# Altium project Simple.PrjPcb
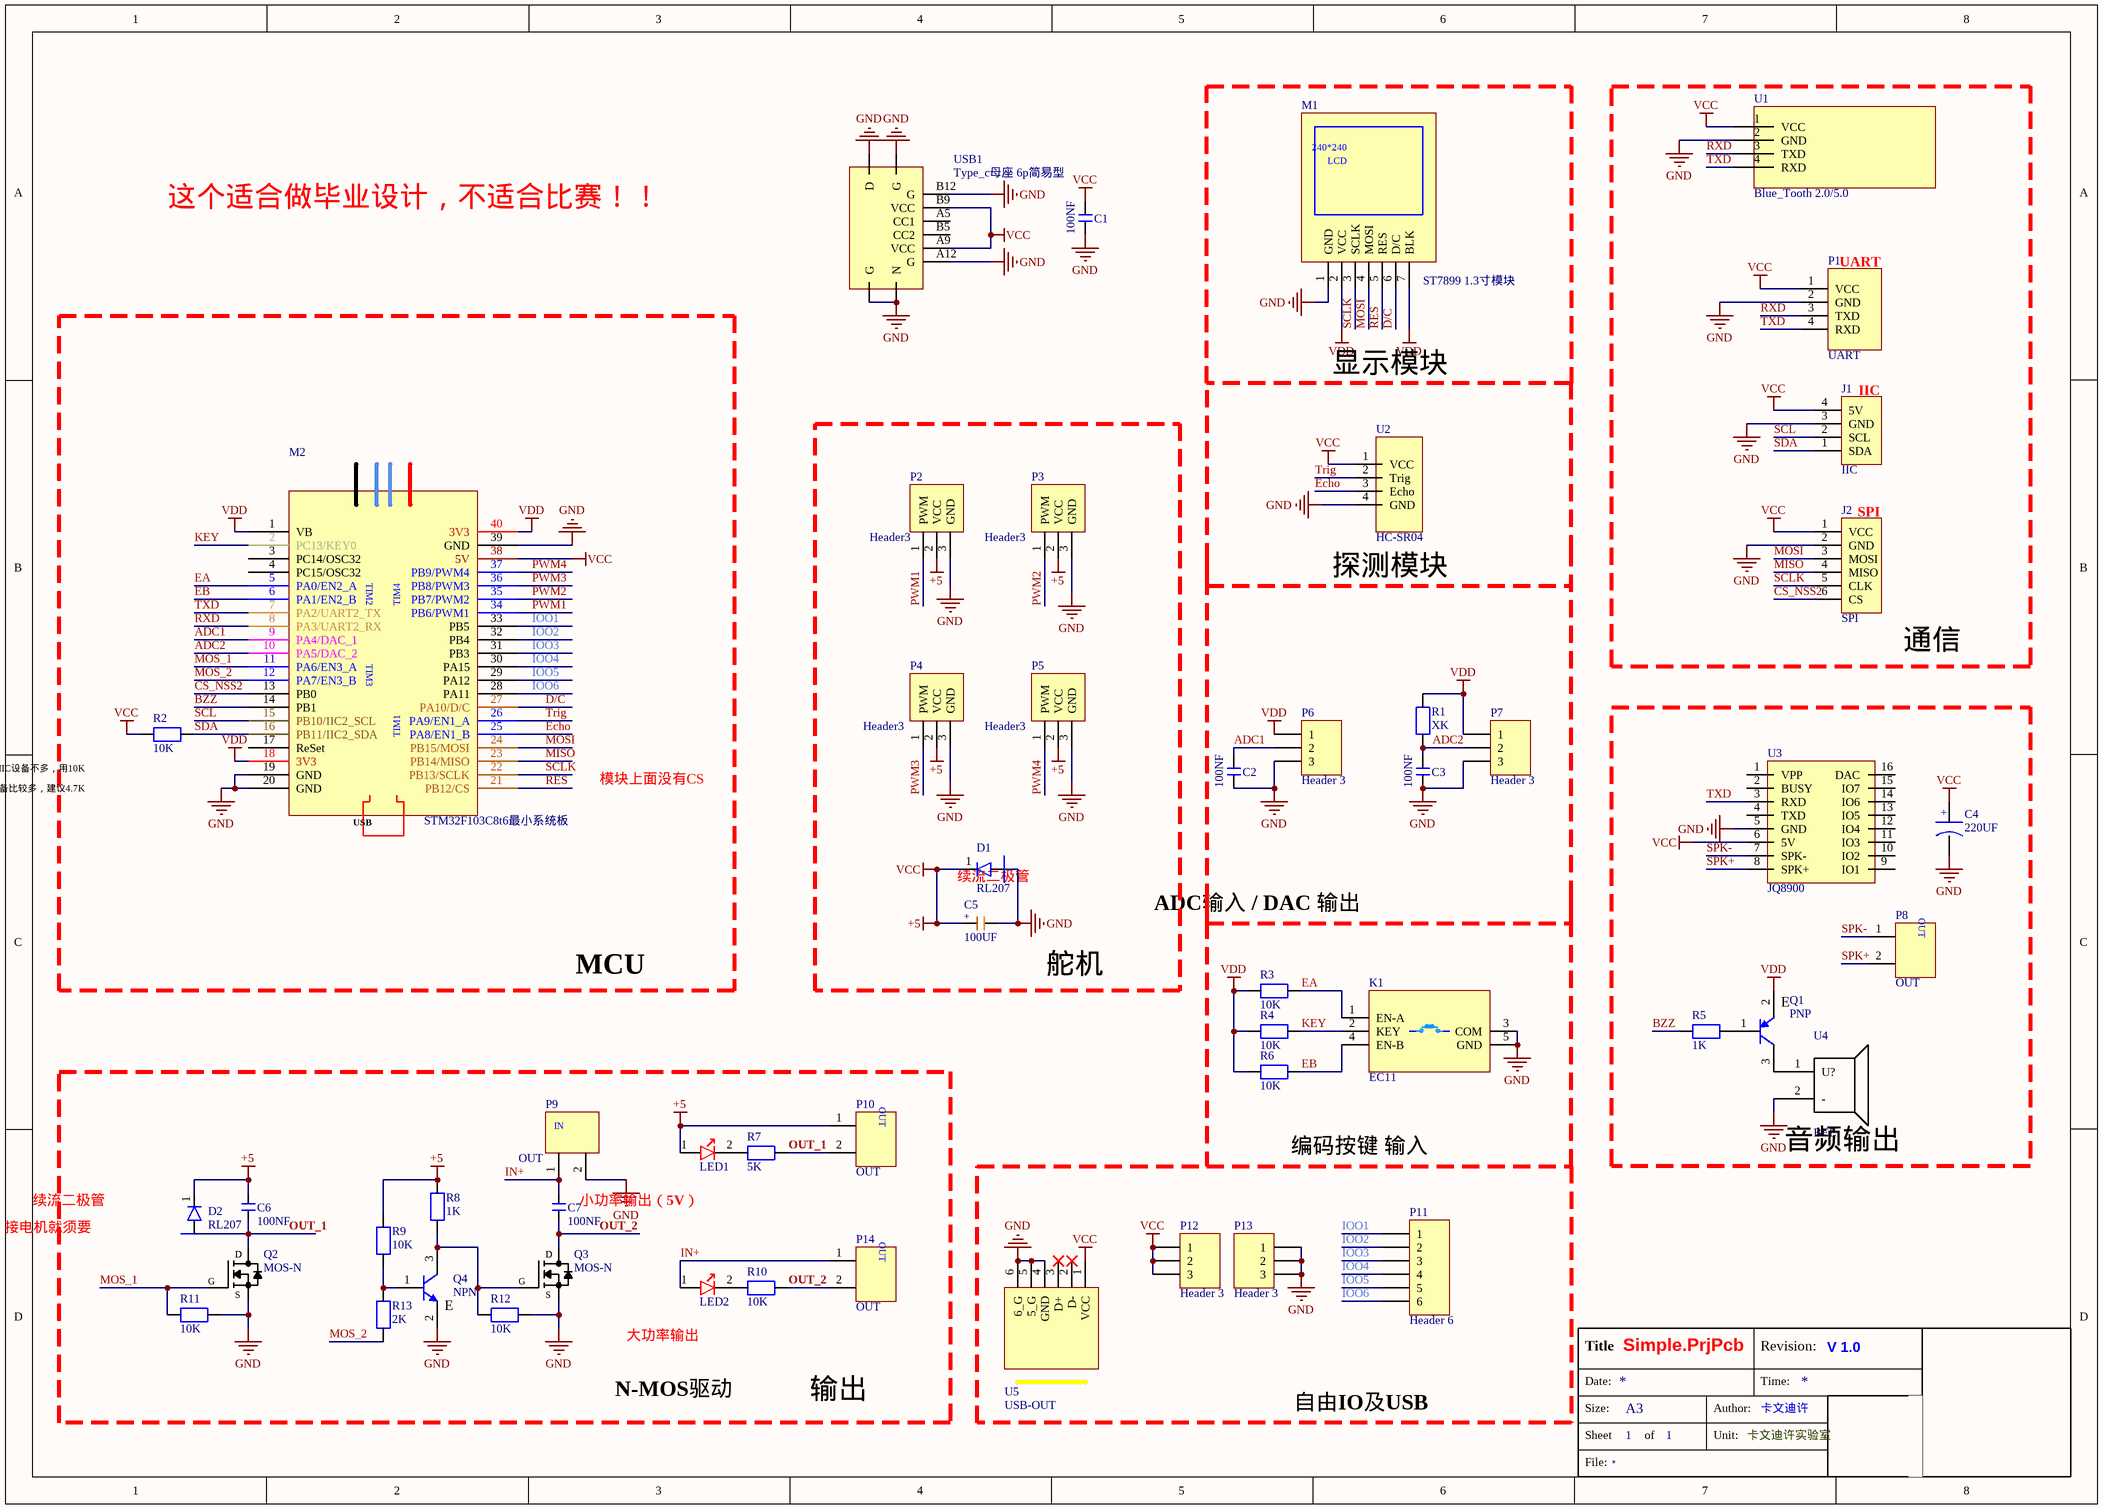
[diagram p0: Sheet.SchDoc]
1 sheet, 53 parts. Net scope: global (net labels, ports and power ports of the same name join across sheets).
Board file: PCB.PcbDoc

## Sheet Sheet.SchDoc
size A3; Author: 卡文迪许; CompanyName: 卡文迪许实验室; Revision: V 1.0; SheetNumber: 1; SheetTotal: 1

### Parts
C1  100NF  [CAP_0603]
C2  100NF  [CAP_0603]
C3  100NF  [CAP_0603]
C4  220UF  [CAP_PR_2.5_6.3_RA]
C5  100UF  [CAP_3528_B]
C6  100NF  [CAP_0603]
C7  100NF  [CAP_0603]
D1  RL207  [Diode_DO15]
D2  RL207  [Diode_DO15]
J1  IIC  [IIC-XH2.54-4PIN]
J2  SPI  [Header 2.54X6]
K1  EC11  [EC-11]
LED1  LED_R/G/B/Y  [LED_5MM]  (value not drawn)
LED2  LED_R/G/B/Y  [LED_5MM]  (value not drawn)
M1  ST7899 1.3寸模块  [LCD_1.3_MODE]
M2  STM32F103C8t6最小系统板  [STM32F103C8_Simple]
P1  UART  [UART]
P2  Header3  [PWM_Steer-F]
P3  Header3  [PWM_Steer-B]
P4  Header3  [PWM_Steer-F]
P5  Header3  [PWM_Steer-B]
P6  Header 3  [Header 2.54X3]
P7  Header 3  [Header 2.54X3]
P8  OUT  [XH2.54-WI-2P]
P9  OUT  [XT60-PW-M20]
P10  OUT  [Header 2.54X2]
P11  Header 6  [Header 2.54X6]
P12  Header 3  [Header 2.54X3]
P13  Header 3  [Header 2.54X3]
P14  OUT  [PIN-2_5.08]
Q1  PNP  [SOT23_3]
Q2  MOS-N  [SOT23_3]
Q3  MOS-N  [TO252_2]
Q4  NPN  [SOT23_3]
R1  XK  [RES_0.4_1/4W]
R2  10K  [RES_0.4_1/4W]
R3  10K  [RES_0.4_1/4W]
R4  10K  [RES_0.4_1/4W]
R5  1K  [RES_0.4_1/4W]
R6  10K  [RES_0.4_1/4W]
R7  5K  [RES_0.4_1/4W]
R8  1K  [RES_0.4_1/4W]
R9  10K  [RES_0.4_1/4W]
R10  10K  [RES_0.4_1/4W]
R11  10K  [RES_0.4_1/4W]
R12  10K  [RES_0.4_1/4W]
R13  2K  [RES_0.4_1/4W]
U1  Blue_Tooth 2.0/5.0  [uart-Haerd]
U2  HC-SR04  [Ultrasonic]
U3  JQ8900  [SpkMo]
U4  BEE  [BEE-FMQ5mm]
U5  USB-OUT  [USB_Bout]
USB1  Type_c母座 6p简易型  [USB-Type-c_6P]

### Blocks framed on the sheet
显示模块: M1
通信: J1 J2 P1 U1
MCU: M2 R2
舵机: C5 D1 P2-P5
音频输出: C4 P8 Q1 R5 U3 U4
输出: C6 C7 D2 LED1 LED2 P9 P10 P14 Q2-Q4 R7-R13

### Nets
+5: C1.2 C4.1 C5.1 C6.2 D1.1(N) D2.1(N) J1.4(5V) J2.1(VCC) LED1.1(+) M2.38(5V) P1.1(VCC) P2.2(VCC) P3.2(VCC) P4.2(VCC) P5.2(VCC) P10.1 P12.1 P12.2 P12.3 R2.1 R8.1 R9.2 U1.1(VCC) U2.1(VCC) U3.6(5V) U5.1(VCC) USB1.A9(VCC) USB1.B9(VCC)  [also labelled VCC]
GND: C1.1 C2.1 C3.1 C4.2 C5.2 D1.2(P) J1.3(GND) J2.2(GND) K1.3(COM) K1.5(GND) M1.1(GND) M2.19(GND) M2.20(GND) M2.39(GND) P1.2(GND) P2.3(GND) P3.3(GND) P4.3(GND) P5.3(GND) P6.3 P7.3 P9.2 P13.1 P13.2 P13.3 Q2.2(S) Q3.2(S) Q4.2(E) R11.2 R12.2 U1.2(GND) U2.4(GND) U3.5(GND) U4.2(-) U5.4(GND) U5.5(5_G) U5.6(6_G) USB1.A(G) USB1.A12(G) USB1.B(N) USB1.B12(G) USB1.C(D) USB1.D(G)
VDD: M1.2(VCC) M1.7(BLK) M2.1(VB) M2.18(3V3) M2.40(3V3) P6.1 P7.1 Q1.2(E) R1.2 R3.1 R4.1 R6.1
ADC1: C2.2 M2.9(PA4/DAC_1) P6.2
ADC2: C3.2 M2.10(PA5/DAC_2) P7.2 R1.1
BZZ: M2.14(PB1) R5.1
CS_NSS2: J2.6(CS) M2.13(PB0)
D/C: M1.6(D/C) M2.27(PA10/D/C)
EA: K1.1(EN-A) M2.5(PA0/EN2_A) R3.2
EB: K1.4(EN-B) M2.6(PA1/EN2_B) R6.2
Echo: M2.25(PA8/EN1_B) U2.3(Echo)
IN+: C7.2 LED2.1(+) P9.1 P14.1
IOO1: M2.33(PB5) P11.1
IOO2: M2.32(PB4) P11.2
IOO3: M2.31(PB3) P11.3
IOO4: M2.30(PA15) P11.4
IOO5: M2.29(PA12) P11.5
IOO6: M2.28(PA11) P11.6
KEY: K1.2(KEY) M2.2(PC13/KEY0) R4.2
MISO: J2.4(MISO) M2.23(PB14/MISO)
MOS_1: M2.11(PA6/EN3_A) Q2.1(G) R11.1
MOS_2: M2.12(PA7/EN3_B) R13.1
MOSI: J2.3(MOSI) M1.4(MOSI) M2.24(PB15/MOSI)
OUT_1: C6.1 D2.2(P) P10.2 Q2.3(D) R7.2
OUT_2: C7.1 P14.2 Q3.3(D) R10.2
PWM1: M2.34(PB6/PWM1) P2.1(PWM)
PWM2: M2.35(PB7/PWM2) P3.1(PWM)
PWM3: M2.36(PB8/PWM3) P4.1(PWM)
PWM4: M2.37(PB9/PWM4) P5.1(PWM)
RES: M1.5(RES) M2.21(PB12/CS)
RXD: M2.8(PA3/UART2_RX) P1.3(TXD) U1.3(TXD)
SCL: J1.2(SCL) M2.15(PB10/IIC2_SCL)
SCLK: J2.5(CLK) M1.3(SCLK) M2.22(PB13/SCLK)
SDA: J1.1(SDA) M2.16(PB11/IIC2_SDA) R2.2
SPK+: P8.2 U3.8(SPK+)
SPK-: P8.1 U3.7(SPK-)
Trig: M2.26(PA9/EN1_A) U2.2(Trig)
TXD: M2.7(PA2/UART2_TX) P1.4(RXD) U1.4(RXD) U3.3(RXD)
NetLED1_2: LED1.2(-) R7.1
NetLED2_2: LED2.2(-) R10.1
NetQ1_1: Q1.1(B) R5.2
NetQ1_3: Q1.3(C) U4.1(U?)
NetQ3_1: Q3.1(G) Q4.3(C) R8.2 R12.1
NetQ4_1: Q4.1(B) R9.1 R13.2

Not connected (* = marked no-connect by the designer): M2 3(PC14/OSC32) 4(PC15/OSC32) 17(ReSet); U3 1(VPP) 2(BUSY) 4(TXD) 9(IO1) 10(IO2) 11(IO3) 12(IO4) 13(IO5) 14(IO6) 15(IO7) 16(DAC); U5 2(D-)* 3(D+)*; USB1 A5(CC1) B5(CC2)

### Notes on the sheet
- 这个适合做毕业设计，不适合比赛！！
- UART
- (near J1) IIC
- SPI
- 探测模块
- (near R2) 这里IIC设备不多，用10K
- (near R2) 如果设备比较多，建议4.7K
- 模块上面没有CS
- 续流二极管
- ADC输入 / DAC 输出
- 编码按键 输入
- 接电机就须要
- (near D2) 续流二极管
- 小功率输出（5V）
- 大功率输出
- N-MOS驱动
- 自由IO及USB
- Title
- Date:
- Revision:
- Time:
- Size:
- Sheet
- A3
- of
- Author:
- Unit:
- File:
- (in symbol CAP_BIG) +
- (in symbol CAP_TA) +
- (in symbol IN _2PIN) IN
- (in symbol LCD_TFT_1.3_MODE) 240*240; LCD
- (in symbol STM32F103C-Sys) TIM2; TIM4; TIM3; TIM1; USB

### Library data of the parts
C1-C3 C6 C7 = CAP: CAP  12~50V
C4 = CAP_BIG: CAP 12V ~ 50V   电解电容
C5 = CAP_TA: CAP  6~12V  钽电容
D1 D2 = Diode-DO: Diode_肖特基/二极管 / 直插
J1 = IIC: MLX90614 GY-906-BCC
J2 = SPI: Heard
K1 = EN-CODE: KEY
LED1 LED2 = LED: LED 5MM
M1 = LCD_TFT_1.3_MODE: SHOW
M2 = STM32F103C-Sys: Mode STM32F103C8t6最小系统板
P1 = UART: Header XH2.54 弯针座 4PIN
P2-P5 = PWM_D: Header
P6 P7 P12 P13 = Header 3: Header, 3-Pin; LatestRevisionDate: 17-Jul-2002; LatestRevisionNote: Re-released for DXP Platform.; Publisher: Altium Limited
P8 P10 = OUT_2PIN: Header
P9 = IN _2PIN: Header
P11 = Header 6: Header, 6-Pin; LatestRevisionDate: 17-Jul-2002; LatestRevisionNote: Re-released for DXP Platform.; Publisher: Altium Limited
P14 = OUT_2PIN: Header KF127a-5.08-2PIN
Q2 = MOS-N: MOSFET N-CH SI2308; Manufacturer: ON Semiconductor; Manufacturer Part Number: NTMFS5C628NLT1G; FET Type: N-Channel; Drive Voltage (Max Rds On,  Min Rds On): 4.5V, 10V; Vgs(th) (Max) @ Id: 2V @ 135µA; Gate Charge (Qg) (Max) @ Vgs: 52nC @ 10V; Input Capacitance (Ciss) (Max) @ Vds: 3600pF @ 25V; Vgs (Max): ±20V; Power Dissipation (Max): 3.7W (Ta), 110W (Tc); Rds On (Max) @ Id, Vgs: 2.4 mOhm @ 50A, 10V; Supplier 1: Digi-Key; Supplier Part Number 1: NTMFS5C628NLT1GOSCT-ND; RoHS: RoHS Compliant; Category: Discrete Semiconductor Products; Stock: 1490; Pricing 1: 1=1.8, 10=1.627, 100=1.3078, 500=1.01716 (USD); Packaging: Cut Tape (CT); Part Status: Active; Technology: MOSFET (Metal Oxide); Current - Continuous Drain (Id) @ 25°C: -; FET Feature: -; Operating Temperature: -55°C ~ 175°C (TJ); Mounting Type: Surface Mount; Supplier Device Package: 5-DFN (5x6) (8-SOFL); Package / Case: 8-PowerTDFN; ComponentLink1URL: http://www.onsemi.com/pub/Collateral/NTMFS5C628NL-D.PDF; ComponentLink1Description: http://www.onsemi.com/pub/Collateral/NTMFS5C628NL-D.PDF; Supplier 2: Digi-Key; Supplier Part Number 2: NTMFS5C628NLT1GOSTR-ND; Pricing 2: 1500=0.81823 (USD)
Q3 = MOS-N: MOSFET N-CH NCE3050K; Manufacturer: ON Semiconductor; Manufacturer Part Number: NTMFS5C628NLT1G; FET Type: N-Channel; Drive Voltage (Max Rds On,  Min Rds On): 4.5V, 10V; Vgs(th) (Max) @ Id: 2V @ 135µA; Gate Charge (Qg) (Max) @ Vgs: 52nC @ 10V; Input Capacitance (Ciss) (Max) @ Vds: 3600pF @ 25V; Vgs (Max): ±20V; Power Dissipation (Max): 3.7W (Ta), 110W (Tc); Rds On (Max) @ Id, Vgs: 2.4 mOhm @ 50A, 10V; Supplier 1: Digi-Key; Supplier Part Number 1: NTMFS5C628NLT1GOSCT-ND; RoHS: RoHS Compliant; Category: Discrete Semiconductor Products; Stock: 1490; Pricing 1: 1=1.8, 10=1.627, 100=1.3078, 500=1.01716 (USD); Packaging: Cut Tape (CT); Part Status: Active; Technology: MOSFET (Metal Oxide); Current - Continuous Drain (Id) @ 25°C: -; FET Feature: -; Operating Temperature: -55°C ~ 175°C (TJ); Mounting Type: Surface Mount; Supplier Device Package: 5-DFN (5x6) (8-SOFL); Package / Case: 8-PowerTDFN; ComponentLink1URL: http://www.onsemi.com/pub/Collateral/NTMFS5C628NL-D.PDF; ComponentLink1Description: http://www.onsemi.com/pub/Collateral/NTMFS5C628NL-D.PDF; Supplier 2: Digi-Key; Supplier Part Number 2: NTMFS5C628NLT1GOSTR-ND; Pricing 2: 1500=0.81823 (USD)
R1-R13 = RES_S: RES 贴片
U1 = HC-02/06: MODE HC-06(记得买底座 排母-4PIN)
U2 = Ultrasonic: Mode
U3 = SPKMO_8900: MODE
U4 = BZZ
U5 = USB-OUT: USB-A母 90 度 带后盖
USB1 = USB-Type_c-6PIn: USB